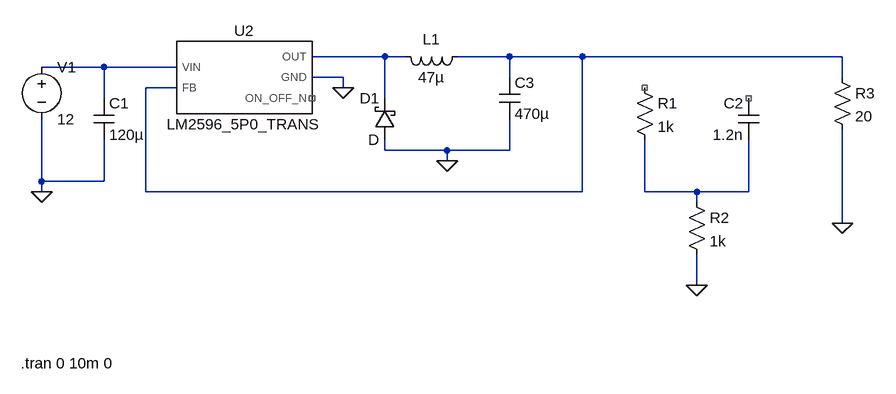
[diagram p0: schematic simulacion.asc]
simulacion.asc, the LTspice schematic file:
Version 4
SHEET 1 1180 680
WIRE 400 112 288 112
WIRE 432 112 400 112
WIRE 592 112 512 112
WIRE 704 112 592 112
WIRE 1104 112 704 112
WIRE -32 128 -128 128
WIRE 80 128 -32 128
WIRE 336 144 288 144
WIRE 592 144 592 112
WIRE 1104 144 1104 112
WIRE 80 160 32 160
WIRE 336 160 336 144
WIRE -32 176 -32 128
WIRE 400 176 400 112
WIRE 400 256 400 240
WIRE 496 256 400 256
WIRE 592 256 592 208
WIRE 592 256 496 256
WIRE 496 272 496 256
WIRE -128 304 -128 208
WIRE -32 304 -32 240
WIRE -32 304 -128 304
WIRE -128 320 -128 304
WIRE 32 320 32 160
WIRE 704 320 704 112
WIRE 704 320 32 320
WIRE 800 320 800 240
WIRE 880 320 800 320
WIRE 960 320 960 240
WIRE 960 320 880 320
WIRE 880 336 880 320
WIRE 1104 368 1104 224
WIRE 880 464 880 416
FLAG -128 320 0
FLAG 336 160 0
FLAG 880 464 0
FLAG 496 272 0
FLAG 1104 368 0
SYMBOL voltage -128 112 R0
WINDOW 123 0 0 Left 0
WINDOW 39 0 0 Left 0
SYMATTR InstName V1
SYMATTR Value 12
SYMBOL cap -48 176 R0
SYMATTR InstName C1
SYMATTR Value 120µ
SYMATTR SpiceLine Rser=25m
SYMBOL res 784 144 R0
SYMATTR InstName R1
SYMATTR Value 1k
SYMBOL cap 976 240 R180
WINDOW 0 24 56 Left 2
WINDOW 3 24 8 Left 2
SYMATTR InstName C2
SYMATTR Value 1.2n
SYMBOL res 864 320 R0
SYMATTR InstName R2
SYMATTR Value 1k
SYMBOL ind 528 96 R90
WINDOW 0 5 56 VBottom 2
WINDOW 3 32 56 VTop 2
SYMATTR InstName L1
SYMATTR Value 47µ
SYMATTR SpiceLine Rser=33m
SYMBOL schottky 416 240 R180
WINDOW 0 24 64 Left 2
WINDOW 3 24 0 Left 2
SYMATTR InstName D1
SYMBOL cap 576 144 R0
SYMATTR InstName C3
SYMATTR Value 470µ
SYMATTR SpiceLine Rser=87m
SYMBOL res 1088 128 R0
SYMATTR InstName R3
SYMATTR Value 20
SYMBOL LM2596_5P0_TRANS 176 144 R0
SYMATTR InstName U2
TEXT -160 584 Left 2 !.tran 0 10m 0

The netlist it stands for:
* simulacion.asc
V1 N003 0 12
C1 N003 0 120µ Rser=25m
R1 NC_01 N004 1k
C2 N004 NC_02 1.2n
R2 N004 0 1k
L1 N002 N001 47µ Rser=33m
D1 0 N001 D
C3 N002 0 470µ Rser=87m
R3 N002 0 20
XU2 N003 N002 N001 0 NC_03 LM2596_5P0_TRANS  ; pins VIN FB OUT GND ON_OFF_N
.model D D
.lib standard.dio
.tran 0 10m 0
.lib C:\Users\lucio\OneDrive\Documentos\LTspiceXVII\lib\sub\LM2596_5P0_TRANS.LIB
.backanno
.end